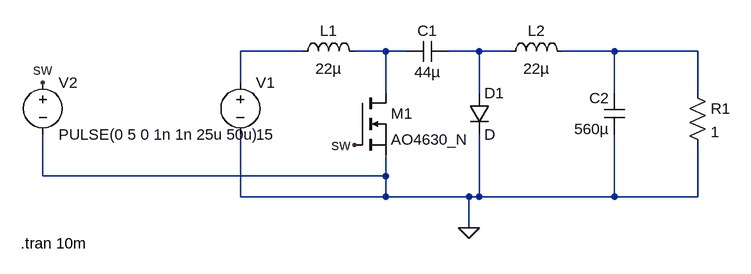
[diagram p0: schematic cuk.asc]
cuk.asc, the LTspice schematic file:
Version 4
SHEET 1 880 680
WIRE 0 80 -96 80
WIRE 128 80 80 80
WIRE 160 80 128 80
WIRE 272 80 224 80
WIRE 320 80 272 80
WIRE 480 80 400 80
WIRE 608 80 480 80
WIRE -96 128 -96 80
WIRE 128 144 128 80
WIRE 272 144 272 80
WIRE 480 144 480 80
WIRE 608 144 608 80
WIRE -400 272 -400 208
WIRE 128 272 128 240
WIRE 128 272 -400 272
WIRE -96 304 -96 208
WIRE 128 304 128 272
WIRE 128 304 -96 304
WIRE 256 304 128 304
WIRE 272 304 272 208
WIRE 272 304 256 304
WIRE 480 304 480 208
WIRE 480 304 272 304
WIRE 608 304 608 224
WIRE 608 304 480 304
WIRE 256 352 256 304
FLAG 256 352 0
FLAG 80 224 sw
FLAG -400 128 sw
SYMBOL ind -16 96 R270
WINDOW 0 32 56 VTop 2
WINDOW 3 5 56 VBottom 2
SYMATTR InstName L1
SYMATTR Value 22µ
SYMBOL ind 304 96 R270
WINDOW 0 32 56 VTop 2
WINDOW 3 5 56 VBottom 2
SYMATTR InstName L2
SYMATTR Value 22µ
SYMBOL cap 224 64 R90
WINDOW 0 0 32 VBottom 2
WINDOW 3 32 32 VTop 2
SYMATTR InstName C1
SYMATTR Value 44µ
SYMBOL cap 496 208 R180
WINDOW 0 24 56 Left 2
WINDOW 3 24 8 Left 2
SYMATTR InstName C2
SYMATTR Value 560µ
SYMBOL res 592 128 R0
SYMATTR InstName R1
SYMATTR Value 1
SYMBOL diode 256 144 R0
SYMATTR InstName D1
SYMBOL nmos 80 144 R0
SYMATTR InstName M1
SYMATTR Value AO4630_N
SYMBOL voltage -96 112 R0
WINDOW 123 0 0 Left 0
WINDOW 39 0 0 Left 0
SYMATTR InstName V1
SYMATTR Value 15
SYMBOL voltage -400 112 R0
WINDOW 123 0 0 Left 0
WINDOW 39 0 0 Left 0
SYMATTR InstName V2
SYMATTR Value PULSE(0 5 0 1n 1n 25u 50u)
TEXT -434 376 Left 2 !.tran 10m

The netlist it stands for:
* cuk.asc
L1 N001 N002 22µ
L2 N003 N004 22µ
C1 N003 N002 44µ
C2 0 N004 560µ
R1 N004 0 1
D1 N003 0 D
M1 N002 sw 0 0 AO4630_N
V1 N001 0 15
V2 sw 0 PULSE(0 5 0 1n 1n 25u 50u)
.model D D
.lib standard.dio
.model NMOS NMOS
.model PMOS PMOS
.lib standard.mos
.tran 10m
.backanno
.end